# Altium project IP_Audio_Terminal.PrjPcb
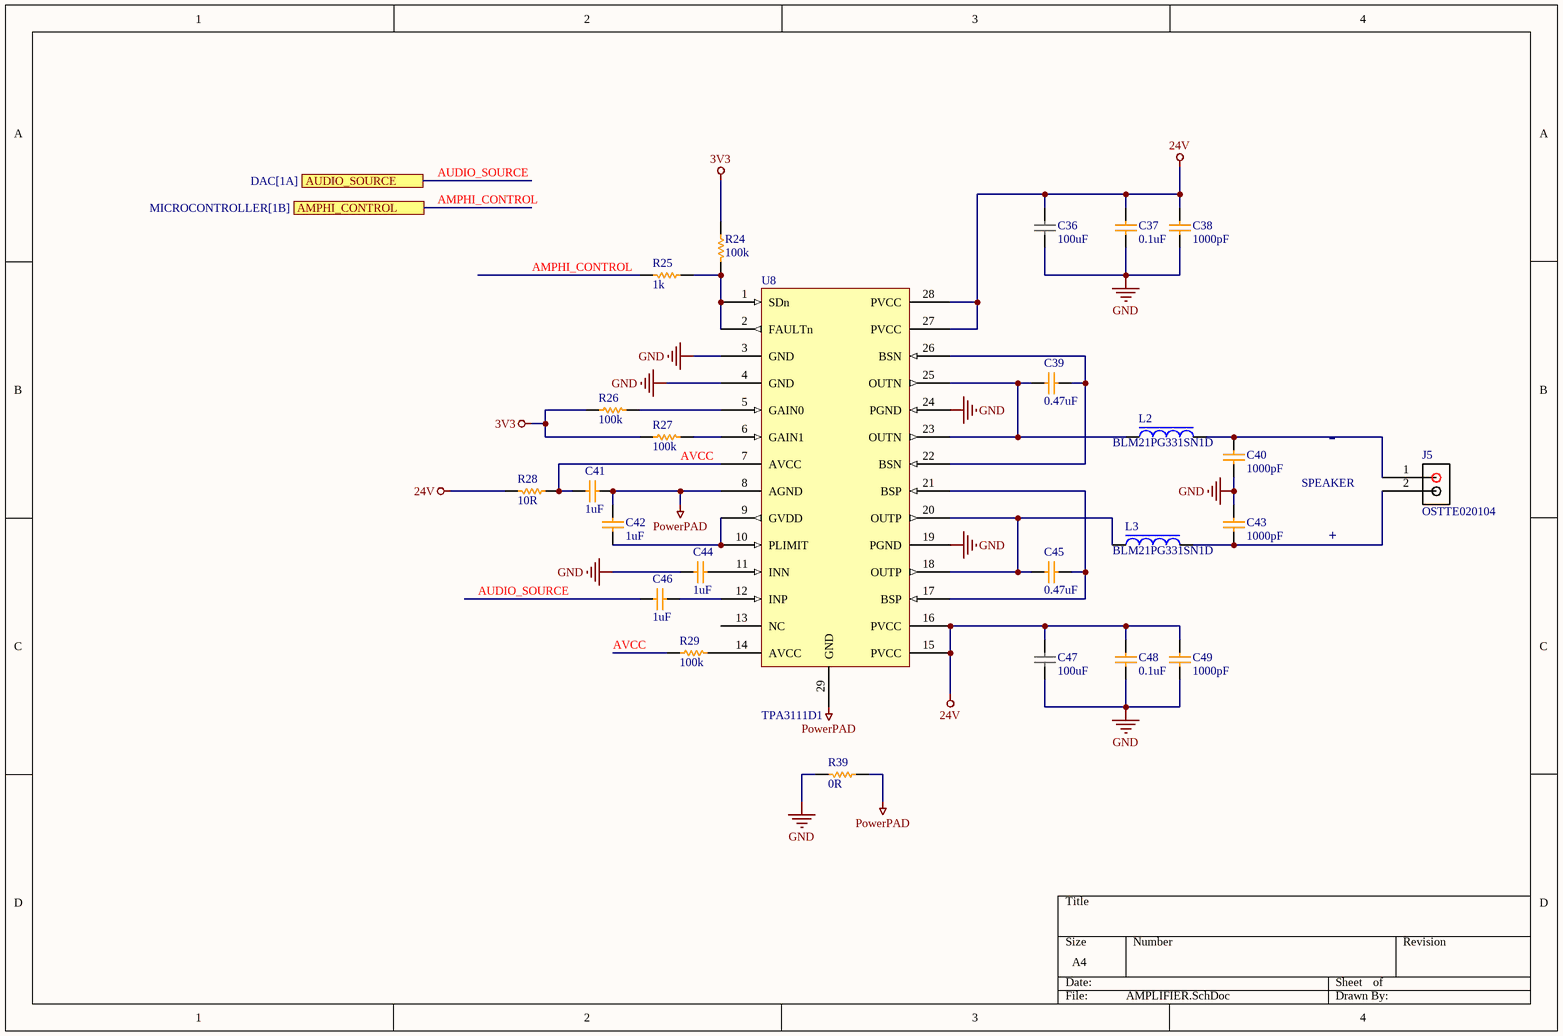
[diagram p0: AMPLIFIER.SchDoc]
6 sheets, 115 parts. Net scope: flat (ports and power ports of the same name join across sheets).
Board file: tetrapcb.PcbDoc
Sheets:
  AMPLIFIER.SchDoc
  DAC.SchDoc
  ETHERNET.SchDoc
  MICROCONTROLLER.SchDoc
  MICROSD.SchDoc
  POWER.SchDoc

## Sheet AMPLIFIER.SchDoc
size A4; SheetNumber: 1; SheetTotal: 6

### Parts
C36  100uF  [CAP-SMD-10x10]
C37  0.1uF  [CAP-0603]
C38  1000pF  [CAP-0603]
C39  0.47uF  [CAP-0603]
C40  1000pF  [CAP-0603]
C41  1uF  [CAP-0603]
C42  1uF  [CAP-0603]
C43  1000pF  [CAP-0603]
C44  1uF  [CAP-0603]
C45  0.47uF  [CAP-0603]
C46  1uF  [CAP-0603]
C47  100uF  [CAP-SMD-10x10]
C48  0.1uF  [CAP-0603]
C49  1000pF  [CAP-0603]
J5  OSTTE020104  [TERMBLK-P3.5-SIDEENT]
L2  BLM21PG331SN1D  [FB-0805]
L3  BLM21PG331SN1D  [FB-0805]
R24  100k  [RES-0603]
R25  1k  [RES-0603]
R26  100k  [RES-0603]
R27  100k  [RES-0603]
R28  10R  [RES-0603]
R29  100k  [RES-0603]
R39  0R  [RES-0603]
U8  TPA3111D1  [28HTSSOP]

### Ports
AMPHI_CONTROL (see MICROCONTROLLER[1B]), AUDIO_SOURCE (see DAC[1A])

### Nets
3V3: R24.2 R26.2 R27.2
24V: C36.1 C37.2 C38.2 C47.1 C48.2 C49.2 R28.1 U8.15(PVCC) U8.16(PVCC) U8.27(PVCC) U8.28(PVCC)
GND: C36.2 C37.1 C38.1 C40.1 C43.2 C44.1 C47.2 C48.1 C49.1 R39.1 U8.3(GND) U8.4(GND) U8.19(PGND) U8.24(PGND)
PowerPAD: C41.2 C42.2 R39.2 U8.8(AGND) U8.29(GND)
AMPHI_CONTROL: R25.1 ; port AMPHI_CONTROL
AUDIO_SOURCE: C46.1 ; port AUDIO_SOURCE
AVCC: C41.1 R28.2 R29.2 U8.7(AVCC)
NetC39_1: C39.1 L2.1 U8.23(OUTN) U8.25(OUTN)
NetC39_2: C39.2 U8.22(BSN) U8.26(BSN)
NetC40_2: C40.2 J5.1 L2.2
NetC42_1: C42.1 U8.9(GVDD) U8.10(PLIMIT)
NetC43_1: C43.1 J5.2 L3.2
NetC44_2: C44.2 U8.11(INN)
NetC45_1: C45.1 L3.1 U8.18(OUTP) U8.20(OUTP)
NetC45_2: C45.2 U8.17(BSP) U8.21(BSP)
NetC46_2: C46.2 U8.12(INP)
NetR24_1: R24.1 R25.2 U8.1(SDn) U8.2(FAULTn)
NetR26_1: R26.1 U8.5(GAIN0)
NetR27_1: R27.1 U8.6(GAIN1)
NetR29_1: R29.1 U8.14(AVCC)

Not connected (* = marked no-connect by the designer): U8 13(NC)

### Notes on the sheet
- -
- SPEAKER
- +

### Library data of the parts
C36 C47 = CAP-SMD-ALUM: CAP ALUM 100UF 20% 50V SMD(UUQ1H101MCL1GS)
C37 C48 = CAP-0603: CAP CER 0.1UF 50V X7R 0805
C38 C40 C43 C49 = CAP-0603: CAP CER 1000PF 50V X7R 0603
C39 C45 = CAP-0603: CAP CER 0.47UF 50V X7R 0805
C41 C42 C44 C46 = CAP-0603: CAP CER 1UF 25V X7R 0603
J5 = OSTTE020104: TERM BLK 2POS SIDE ENT 3.5MM PCB
L2 L3 = FB-0805: FERRITE BEAD 330 OHM 0805 1LN
R24 R26 R27 R29 = RES-0603: RES SMD 100K OHM 1% 1/10W 0603
R25 = RES-0603: RES SMD 1K OHM 1% 1/10W 0603
R28 = RES-0603: RES SMD 10 OHM 1% 1/10W 0603
R39 = RES-0603: RES SMD 0 OHM 1% 1/10W 0603
U8 = TPA3111D1: IC AMP CLASS D MONO 10W 28HTSSOP

## Sheet DAC.SchDoc
size A4; SheetNumber: 2; SheetTotal: 6
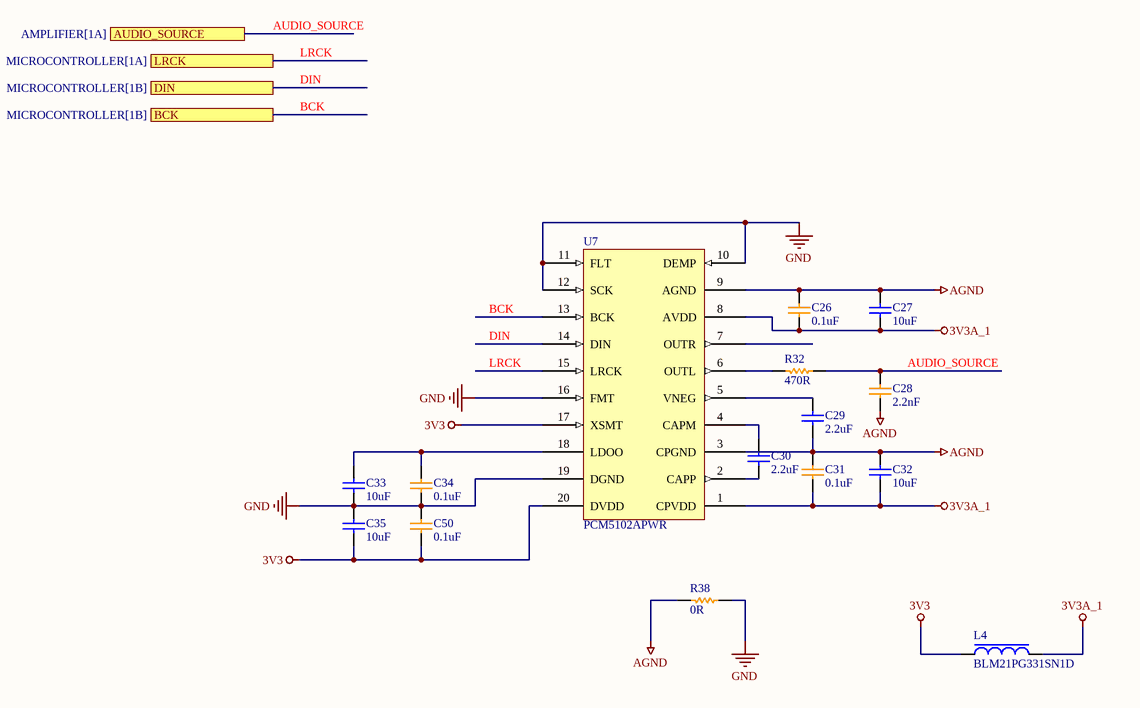
[diagram p1: DAC.SchDoc]

### Parts
C26  0.1uF  [CAP-0603]
C27  10uF  [CAP-0805]
C28  2.2nF  [CAP-0603]
C29  2.2uF  [CAP-0805]
C30  2.2uF  [CAP-0805]
C31  0.1uF  [CAP-0603]
C32  10uF  [CAP-0805]
C33  10uF  [CAP-0805]
C34  0.1uF  [CAP-0603]
C35  10uF  [CAP-0805]
C50  0.1uF  [CAP-0603]
L4  BLM21PG331SN1D  [FB-0805]
R32  470R  [RES-0603]
R38  0R  [RES-0603]
U7  PCM5102APWR  [20-TSSOP]

### Ports
AUDIO_SOURCE (see AMPLIFIER[1A]), BCK (see MICROCONTROLLER[1B]), DIN (see MICROCONTROLLER[1B]), LRCK (see MICROCONTROLLER[1A])

### Nets
3V3: C35.2 C50.2 L4.1 U7.17(XSMT) U7.20(DVDD)
3V3A_1: C26.1 C27.1 C31.1 C32.1 L4.2 U7.1(CPVDD) U7.8(AVDD)
AGND: C26.2 C27.2 C28.2 C29.1 C31.2 C32.2 R38.1 U7.3(CPGND) U7.9(AGND)
GND: C33.2 C34.2 C35.1 C50.1 R38.2 U7.10(DEMP) U7.11(FLT) U7.12(SCK) U7.16(FMT) U7.19(DGND)
AUDIO_SOURCE: C28.1 R32.2 ; port AUDIO_SOURCE
BCK: U7.13(BCK) ; port BCK
DIN: U7.14(DIN) ; port DIN
LRCK: U7.15(LRCK) ; port LRCK
NetC29_2: C29.2 U7.5(VNEG)
NetC30_1: C30.1 U7.2(CAPP)
NetC30_2: C30.2 U7.4(CAPM)
NetC33_1: C33.1 C34.1 U7.18(LDOO)
NetR32_1: R32.1 U7.6(OUTL)

Not connected (* = marked no-connect by the designer): U7 7(OUTR)

### Library data of the parts
C26 C31 C34 C50 = CAP-0603: CAP CER 0.1UF 10V X7R 0603
C27 C32 C35 = CAP-0805: CAP CER 10UF 10V X5R 0805
C28 = CAP-0603: CAP CER 2.2NF 10V C0G/NP0 0603
C29 C30 = CAP-0805: CAP CER 2.2UF 10V X5R 0805
C33 = CAP-0805: CAP CER 10UF 16V X5R 0805
L4 = FB-0805: FERRITE BEAD 330 OHM 0805 1LN
R32 R38 = RES-0603: RES SMD 470 OHM 1% 1/10W 0603
U7 = PCM5102APWR: IC DAS/ADC/DAC SPECIAL 20-TSSOP

## Sheet ETHERNET.SchDoc
size A4; SheetNumber: 3; SheetTotal: 6
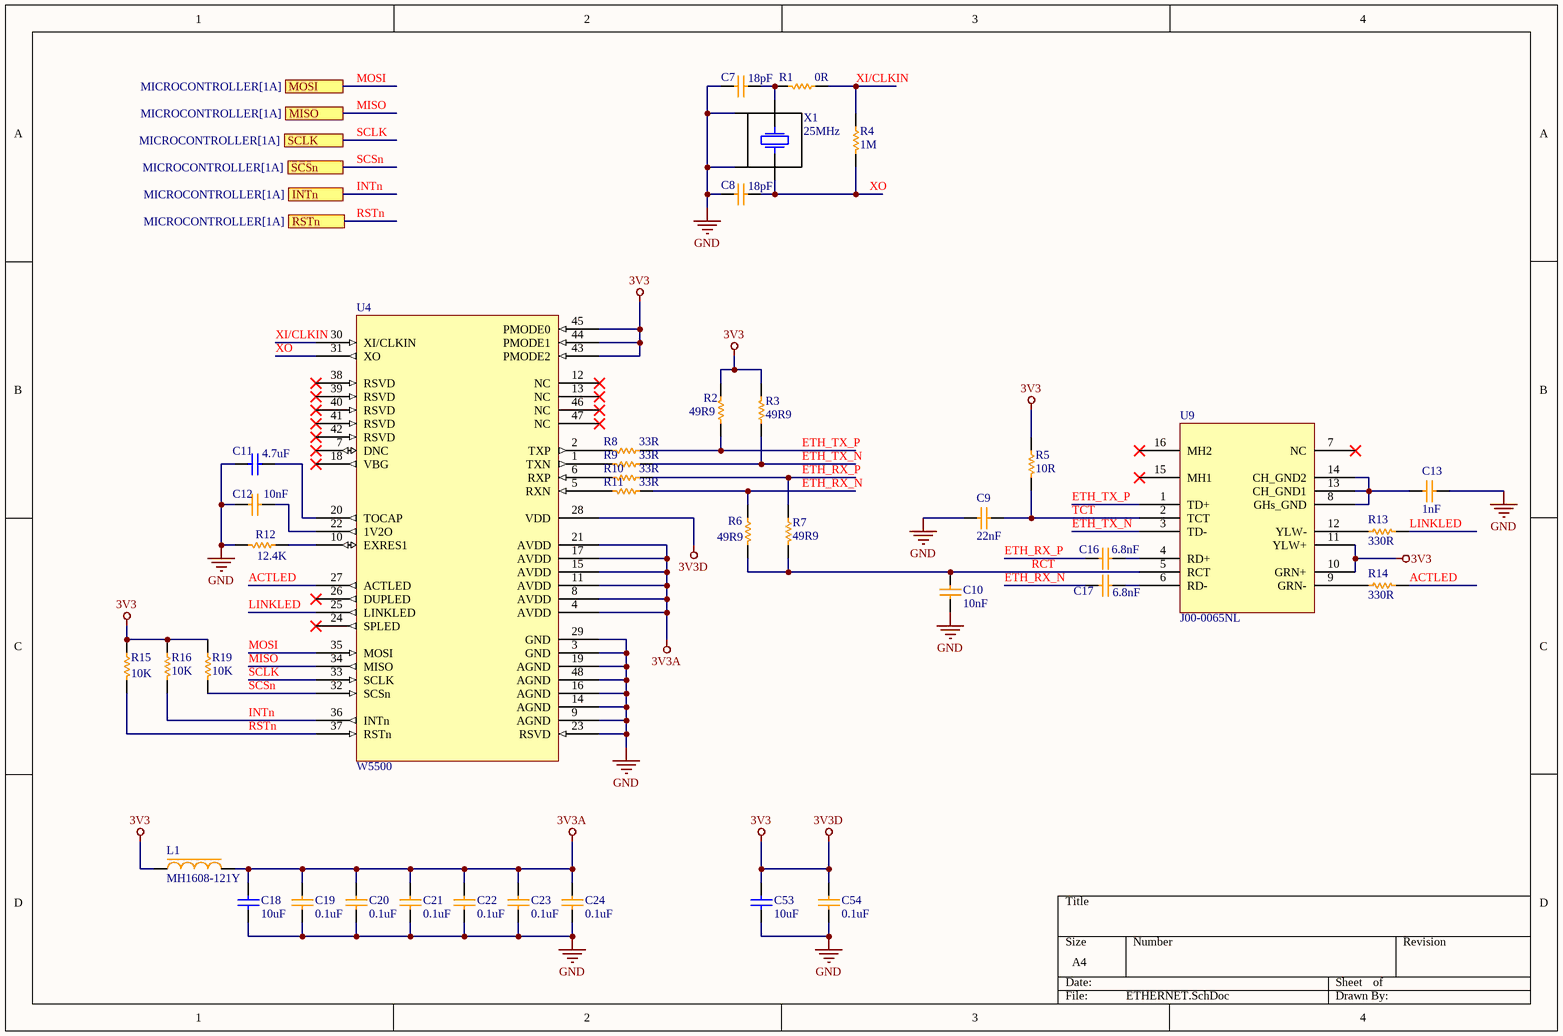
[diagram p2: ETHERNET.SchDoc]

### Parts
C7  18pF  [CAP-0603]
C8  18pF  [CAP-0603]
C9  22nF  [CAP-0603]
C10  10nF  [CAP-0603]
C11  4.7uF  [CAP-0805]
C12  10nF  [CAP-0603]
C13  1nF  [CAP-0603]
C16  6.8nF  [CAP-0603]
C17  6.8nF  [CAP-0603]
C18  10uF  [CAP-0805]
C19  0.1uF  [CAP-0603]
C20  0.1uF  [CAP-0603]
C21  0.1uF  [CAP-0603]
C22  0.1uF  [CAP-0603]
C23  0.1uF  [CAP-0603]
C24  0.1uF  [CAP-0603]
C53  10uF  [CAP-0805]
C54  0.1uF  [CAP-0603]
L1  MH1608-121Y  [FB-0603]
R1  0R  [RES-0603]
R2  49R9  [RES-0603]
R3  49R9  [RES-0603]
R4  1M  [RES-0603]
R5  10R  [RES-0603]
R6  49R9  [RES-0603]
R7  49R9  [RES-0603]
R8  33R  [RES-0603]
R9  33R  [RES-0603]
R10  33R  [RES-0603]
R11  33R  [RES-0603]
R12  12.4K  [RES-0603]
R13  330R  [RES-0603]
R14  330R  [RES-0603]
R15  10K  [RES-0603]
R16  10K  [RES-0603]
R19  10K  [RES-0603]
U4  W5500  [48LQFP]
U9  J00-0065NL  [J00-0065NL]
X1  25MHz  [CRYSTAL-2520]

### Ports
INTn (see MICROCONTROLLER[1A]), MISO (see MICROCONTROLLER[1A]), MOSI (see MICROCONTROLLER[1A]), RSTn (see MICROCONTROLLER[1A]), SCLK (see MICROCONTROLLER[1A]), SCSn (see MICROCONTROLLER[1A])

### Nets
3V3: C53.2 C54.2 L1.1 R2.1 R3.1 R5.2 R15.2 R16.2 R19.2 U4.28(VDD) U4.43(PMODE2) U4.44(PMODE1) U4.45(PMODE0) U9.10(GRN+) U9.11(YLW+)  [also labelled 3V3D]
3V3A: C18.2 C19.2 C20.2 C21.2 C22.2 C23.2 C24.2 L1.2 U4.4(AVDD) U4.8(AVDD) U4.11(AVDD) U4.15(AVDD) U4.17(AVDD) U4.21(AVDD)
GND: C7.1 C8.1 C9.2 C10.1 C11.1 C12.2 C13.2 C18.1 C19.1 C20.1 C21.1 C22.1 C23.1 C24.1 C53.1 C54.1 R12.1 U4.3(GND) U4.9(AGND) U4.14(AGND) U4.16(AGND) U4.19(AGND) U4.23(RSVD) U4.29(GND) U4.48(AGND) X1.2 X1.4
ACTLED: R14.1 U4.27(ACTLED)
ETH_RX_N: C17.1 R6.2 R11.2
ETH_RX_P: C16.1 R7.2 R10.2
ETH_TX_N: R3.2 R9.2 U9.3(TD-)
ETH_TX_P: R2.2 R8.2 U9.1(TD+)
INTn: R16.1 U4.36(INTn) ; port INTn
LINKLED: R13.1 U4.25(LINKLED)
MISO: U4.34(MISO) ; port MISO
MOSI: U4.35(MOSI) ; port MOSI
RCT: C10.2 R6.1 R7.1 U9.5(RCT)
RSTn: R15.1 U4.37(RSTn) ; port RSTn
SCLK: U4.33(SCLK) ; port SCLK
SCSn: R19.1 U4.32(SCSn) ; port SCSn
TCT: C9.1 R5.1 U9.2(TCT)
XI/CLKIN: R1.2 R4.2 U4.30(XI/CLKIN)
XO: C8.2 R4.1 U4.31(XO) X1.3
NetC7_2: C7.2 R1.1 X1.1
NetC11_2: C11.2 U4.20(TOCAP)
NetC12_1: C12.1 U4.22(1V2O)
NetC13_1: C13.1 U9.8(GHs_GND) U9.13(CH_GND1) U9.14(CH_GND2)
NetC16_2: C16.2 U9.4(RD+)
NetC17_2: C17.2 U9.6(RD-)
NetR8_1: R8.1 U4.2(TXP)
NetR9_1: R9.1 U4.1(TXN)
NetR10_1: R10.1 U4.6(RXP)
NetR11_1: R11.1 U4.5(RXN)
NetR12_2: R12.2 U4.10(EXRES1)
NetR13_2: R13.2 U9.12(YLW-)
NetR14_2: R14.2 U9.9(GRN-)

Not connected (* = marked no-connect by the designer): U4 7(DNC)* 12(NC)* 13(NC)* 18(VBG)* 24(SPLED)* 26(DUPLED)* 38(RSVD)* 39(RSVD)* 40(RSVD)* 41(RSVD)* 42(RSVD)* 46(NC)* 47(NC)*; U9 7(NC)* 15(MH1)* 16(MH2)*

### Library data of the parts
C7 C8 = CAP-0603: CAP CER 18PF 50V C0G/NP0 0603
C9 = CAP-0603: CAP CER 22NF 50V X7R 0603
C10 C12 = CAP-0603: CAP CER 1ONF 50V X7R 0603
C11 = CAP-0805: CAP CER 4.7UF 16V X7R 0805
C13 = CAP-0603: CAP CER 1NF 2000V X7R 0603
C16 C17 = CAP-0603: CAP CER 6800PF 50V X7R 0603
C18 C53 = CAP-0805: CAP CER 10UF 16V X5R 0805
C19-C24 C54 = CAP-0603: CAP CER 0.1UF 50V X7R 0603
L1 = FB-0603: FERRITE BEAD 120 OHM 0603 1LN
R1 = RES-0603: RES SMD 0 OHM JUMPER 1/10W 0603
R2 R3 R6 R7 = RES-0603: RES SMD 49.9 OHM 1% 1/10W 0603
R4 = RES-0603: RES SMD 1M OHM 1% 1/10W 0603
R5 = RES-0603: RES SMD 10 OHM 1% 1/10W 0603
R8-R11 = RES-0603: RES SMD 33 OHM 1% 1/10W 0603
R12 = RES-0603: RES SMD 12.4K OHM 1% 1/10W 0603
R13 R14 = RES-0603: RES SMD 330 OHM 5% 1/10W 0603
R15 R16 R19 = RES-0603: RES SMD 10K OHM 5% 1/10W 0603
U4 = W5500: IC CTLR 3-1 ETH TCP/IP 48LQFP
U9 = J00-0065NL: CONN JACK 1PORT PCB
X1 = CRYSTAL-2520: 122M4-25.000F13DWNJK / (2520,25MHz,13pF,10ppm,-40-105,30)

## Sheet MICROCONTROLLER.SchDoc
size A4; SheetNumber: 4; SheetTotal: 6
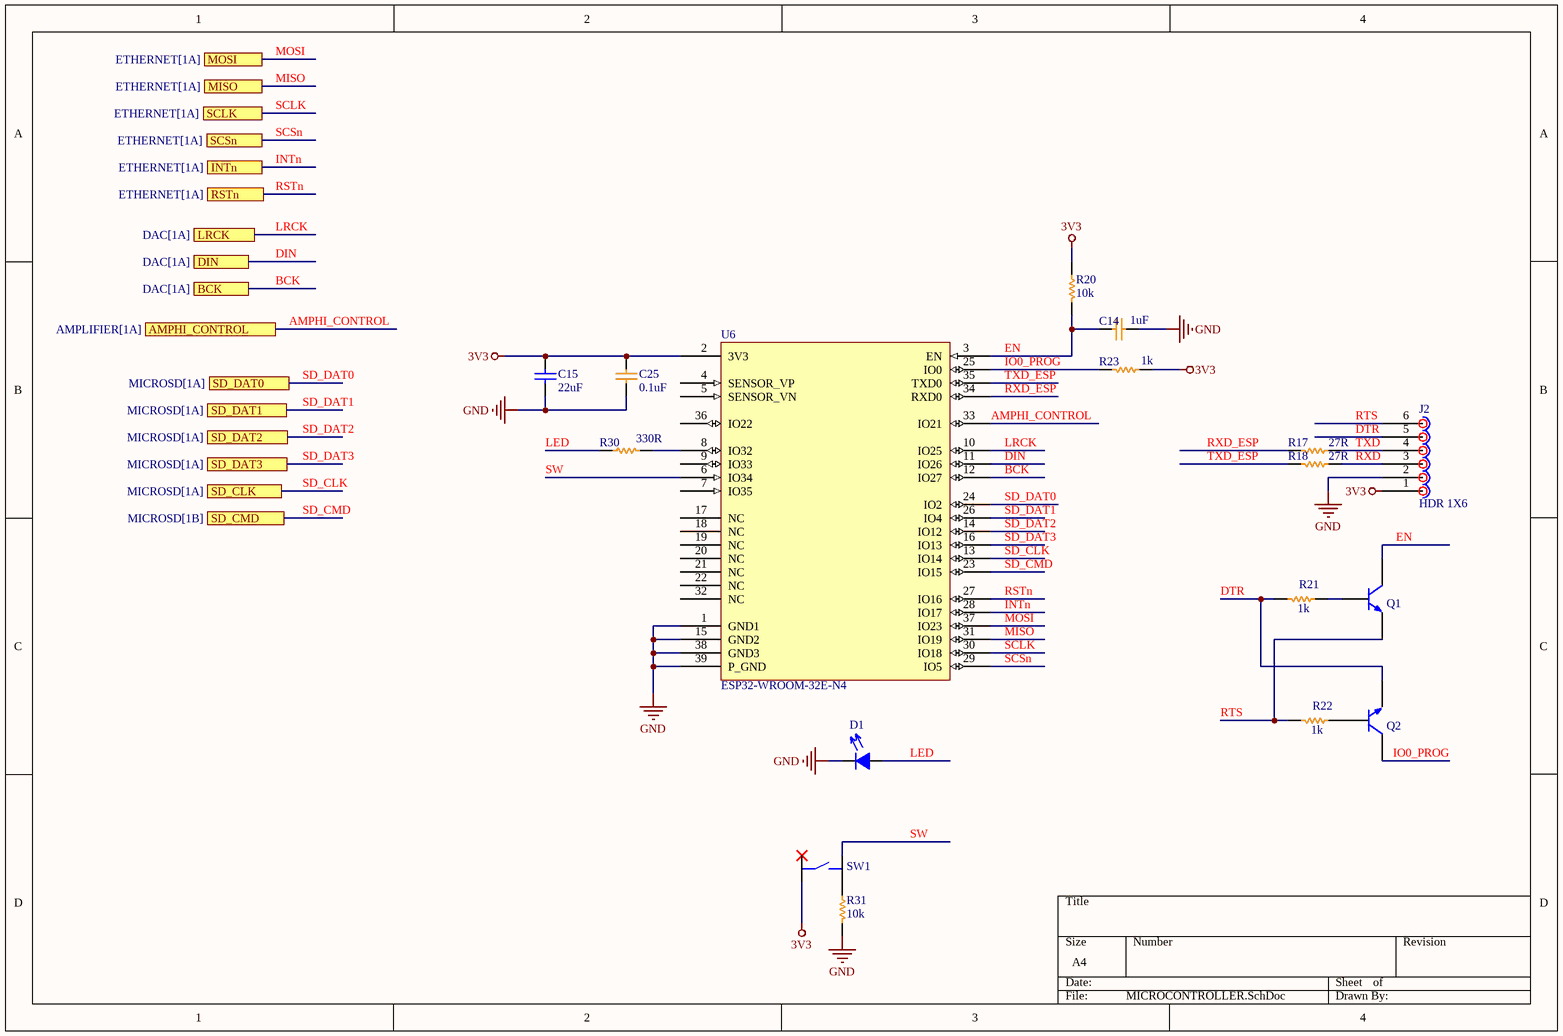
[diagram p3: MICROCONTROLLER.SchDoc]

### Parts
C14  1uF  [CAP-0603]
C15  22uF  [CAP-0805]
C25  0.1uF  [CAP-0603]
D1  LTST-C170GKT  [LED-0805]  (value not drawn)
J2  HDR 1X6  [HDR 1X6]
Q1  S8050  [SOT-23]  (value not drawn)
Q2  S8050  [SOT-23]  (value not drawn)
R17  27R  [RES-0603]
R18  27R  [RES-0603]
R20  10k  [RES-0603]
R21  1k  [RES-0603]
R22  1k  [RES-0603]
R23  1k  [RES-0603]
R30  330R  [RES-0603]
R31  10k  [RES-0603]
SW1  PTS645SK43SMTR92 LFS  [SW-SMD-6x6]  (value not drawn)
U6  ESP32-WROOM-32E-N4  [ESP32-WROOM-32E-N4]

### Ports
AMPHI_CONTROL (see AMPLIFIER[1A]), BCK (see DAC[1A]), DIN (see DAC[1A]), INTn (see ETHERNET[1A]), LRCK (see DAC[1A]), MISO (see ETHERNET[1A]), MOSI (see ETHERNET[1A]), RSTn (see ETHERNET[1A]), SCLK (see ETHERNET[1A]), SCSn (see ETHERNET[1A]), SD_CLK (see MICROSD[1A]), SD_CMD (see MICROSD[1B]), SD_DAT0 (see MICROSD[1A]), SD_DAT1 (see MICROSD[1A]), SD_DAT2 (see MICROSD[1A]), SD_DAT3 (see MICROSD[1A])

### Nets
3V3: C15.2 C25.2 J2.1 R20.2 R23.2 SW1.4 U6.2(3V3)
GND: C14.1 C15.1 C25.1 D1.2 J2.2 R31.1 U6.1(GND1) U6.15(GND2) U6.38(GND3) U6.39(P_GND)
AMPHI_CONTROL: U6.33(IO21) ; port AMPHI_CONTROL
BCK: U6.12(IO27) ; port BCK
DIN: U6.11(IO26) ; port DIN
DTR: J2.5 Q2.2 R21.1
EN: C14.2 Q1.3 R20.1 U6.3(EN)
INTn: U6.28(IO17) ; port INTn
IO0_PROG: Q2.3 R23.1 U6.25(IO0)
LED: D1.1 R30.2
LRCK: U6.10(IO25) ; port LRCK
MISO: U6.31(IO19) ; port MISO
MOSI: U6.37(IO23) ; port MOSI
RSTn: U6.27(IO16) ; port RSTn
RTS: J2.6 Q1.2 R22.1
RXD: J2.3 R18.2
RXD_ESP: R17.1 U6.34(RXD0)
SCLK: U6.30(IO18) ; port SCLK
SCSn: U6.29(IO5) ; port SCSn
SD_CLK: U6.13(IO14) ; port SD_CLK
SD_CMD: U6.23(IO15) ; port SD_CMD
SD_DAT0: U6.24(IO2) ; port SD_DAT0
SD_DAT1: U6.26(IO4) ; port SD_DAT1
SD_DAT2: U6.14(IO12) ; port SD_DAT2
SD_DAT3: U6.16(IO13) ; port SD_DAT3
SW: SW1.1 U6.6(IO34)
TXD: J2.4 R17.2
TXD_ESP: R18.1 U6.35(TXD0)
NetQ1_1: Q1.1 R21.2
NetQ2_1: Q2.1 R22.2
NetR30_1: R30.1 U6.8(IO32)
NetR31_2: R31.2 SW1.2

Not connected (* = marked no-connect by the designer): SW1 3*; U6 4(SENSOR_VP) 5(SENSOR_VN) 7(IO35) 9(IO33) 17(NC) 18(NC) 19(NC) 20(NC) 21(NC) 22(NC) 32(NC) 36(IO22)

### Library data of the parts
C14 = CAP-0603: CAP CER 1UF 10V X7R 0603
C15 = CAP-0805: CAP CER 22UF 10V X5R 0805
C25 = CAP-0603: CAP CER 0.1UF 10V X7R 0603
D1 = LTST-C170GKT: LED GREEN CLEAR SMD
Q1 Q2 = S8050: TRANS NPN 25V 0.5A SOT-23
R17 R18 = RES-0603: RES SMD 27 OHM 1% 1/10W 0603
R20 R31 = RES-0603: RES SMD 10K OHM 1% 1/10W 0603
R21-R23 = RES-0603: RES SMD 1K OHM 1% 1/10W 0603
R30 = RES-0603: RES SMD 330 OHM 5% 1/10W 0603
SW1 = PTS645SK43SMTR92 LFS: G TYPE SMT SWITCH TACTILE SPST-NO 0.05A 12V
U6 = ESP32-WROOM-32E-N4: RF TXRX MOD BT WIFI TH SMD

## Sheet MICROSD.SchDoc
size A4; SheetNumber: 5; SheetTotal: 6
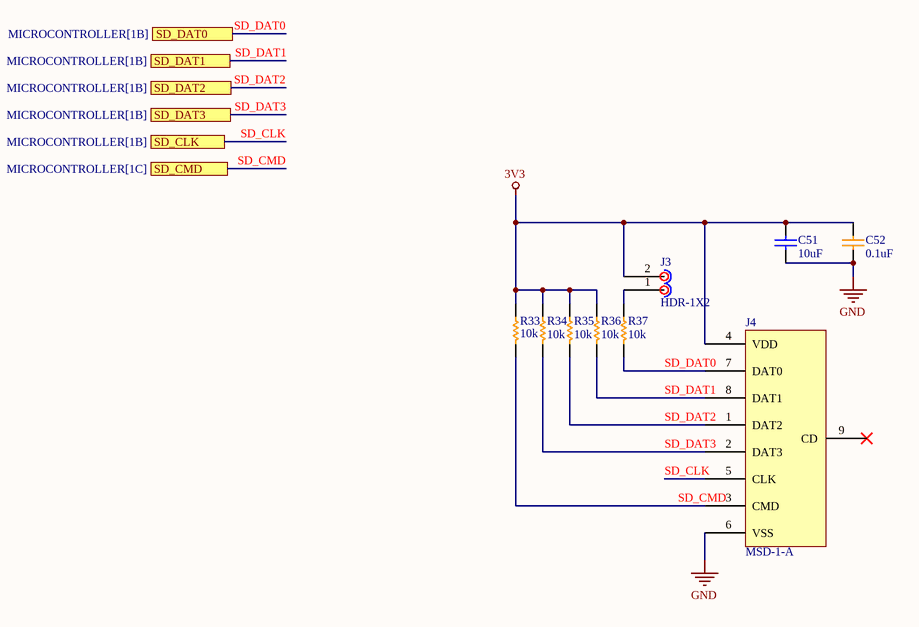
[diagram p4: MICROSD.SchDoc]

### Parts
C51  10uF  [CAP-0805]
C52  0.1uF  [CAP-0603]
J3  HDR-1X2  [HDR-1X2]
J4  MSD-1-A  [MSD-1-A]
R33  10k  [RES-0603]
R34  10k  [RES-0603]
R35  10k  [RES-0603]
R36  10k  [RES-0603]
R37  10k  [RES-0603]

### Ports
SD_CLK (see MICROCONTROLLER[1B]), SD_CMD (see MICROCONTROLLER[1C]), SD_DAT0 (see MICROCONTROLLER[1B]), SD_DAT1 (see MICROCONTROLLER[1B]), SD_DAT2 (see MICROCONTROLLER[1B]), SD_DAT3 (see MICROCONTROLLER[1B])

### Nets
3V3: C51.2 C52.2 J3.2 J4.4(VDD) R33.2 R34.2 R35.2 R36.2
GND: C51.1 C52.1 J4.6(VSS)
SD_CLK: J4.5(CLK) ; port SD_CLK
SD_CMD: J4.3(CMD) R33.1 ; port SD_CMD
SD_DAT0: J4.7(DAT0) R37.1 ; port SD_DAT0
SD_DAT1: J4.8(DAT1) R36.1 ; port SD_DAT1
SD_DAT2: J4.1(DAT2) R35.1 ; port SD_DAT2
SD_DAT3: J4.2(DAT3) R34.1 ; port SD_DAT3
NetJ3_1: J3.1 R37.2

Not connected (* = marked no-connect by the designer): J4 9(CD)*

### Library data of the parts
C51 = CAP-0805: CAP CER 22UF 10V X5R 0805
C52 = CAP-0603: CAP CER 0.1UF 10V X7R 0603
J4 = MSD-1-A: CONN MICROSD CARD R/A SMD
R33-R37 = RES-0603: RES SMD 10K OHM 1% 1/10W 0603

## Sheet POWER.SchDoc
size A4; SheetNumber: 6; SheetTotal: 6
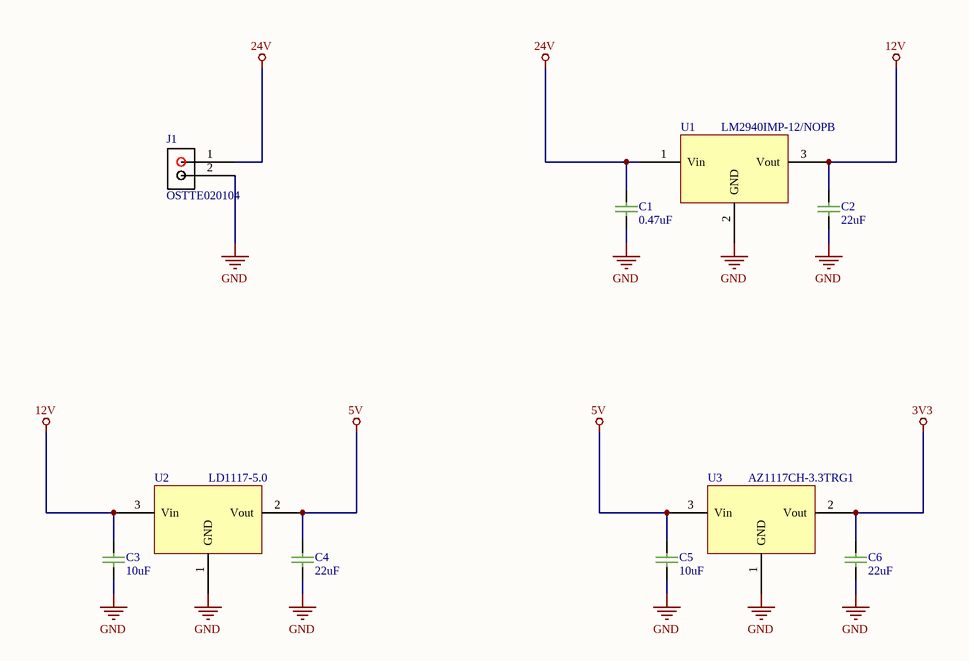
[diagram p5: POWER.SchDoc]

### Parts
C1  0.47uF  [CAP-1206]
C2  22uF  [CAP-1206]
C3  10uF  [CAP-1206]
C4  22uF  [CAP-1206]
C5  10uF  [CAP-1206]
C6  22uF  [CAP-1206]
J1  OSTTE020104  [TERMBLK-P3.5-SIDEENT]
U1  LM2940IMP-12/NOPB  [SOT-223]
U2  LD1117-5.0  [SOT-223]
U3  AZ1117CH-3.3TRG1  [SOT-223]

### Nets
3V3: C6.2 U3.2(Vout)
5V: C4.2 C5.2 U2.2(Vout) U3.3(Vin)
12V: C2.2 C3.2 U1.3(Vout) U2.3(Vin)
24V: C1.2 J1.1 U1.1(Vin)
GND: C1.1 C2.1 C3.1 C4.1 C5.1 C6.1 J1.2 U1.2(GND) U2.1(GND) U3.1(GND)

### Library data of the parts
C1 = CAP-1206: CAP CER 0.47UF 50V X7R 1206
C2 = CAP-1206: CAP CER 22UF 25V X5R 1206
C3 = CAP-1206: CAP CER 10UF 25V X5R 1206
C4 = CAP-1206: CAP CER 22UF 16V X5R 1206
C5 = CAP-1206: CAP CER 10UF 16V X5R 1206
C6 = CAP-1206: CAP CER 22UF 10V X5R 1206
J1 = OSTTE020104: TERM BLK 2POS SIDE ENT 3.5MM PCB
U1 = LM2940IMP-12/NOPB: IC REG LINEAR 12V 1A SOT-223-4
U2 = LD1117-5.0: IC REG LINEAR 5V 1A SOT-223-3L
U3 = AZ1117CH-3.3TRG1: IC REG LINEAR 3.3V 1A SOT-223-3

## Nets that join several sheets
3V3: AMPLIFIER (R24.2 R26.2 R27.2), DAC (5 pins), ETHERNET (15 pins), MICROCONTROLLER (7 pins), MICROSD (8 pins), POWER (C6.2 U3.2)
24V: AMPLIFIER (11 pins), POWER (C1.2 J1.1 U1.1)
GND: AMPLIFIER (14 pins), DAC (10 pins), ETHERNET (27 pins), MICROCONTROLLER (10 pins), MICROSD (C51.1 C52.1 J4.6), POWER (10 pins)
AMPHI_CONTROL: AMPLIFIER (R25.1), MICROCONTROLLER (U6.33)
AUDIO_SOURCE: AMPLIFIER (C46.1), DAC (C28.1 R32.2)
BCK: DAC (U7.13), MICROCONTROLLER (U6.12)
DIN: DAC (U7.14), MICROCONTROLLER (U6.11)
INTn: ETHERNET (R16.1 U4.36), MICROCONTROLLER (U6.28)
LRCK: DAC (U7.15), MICROCONTROLLER (U6.10)
MISO: ETHERNET (U4.34), MICROCONTROLLER (U6.31)
MOSI: ETHERNET (U4.35), MICROCONTROLLER (U6.37)
RSTn: ETHERNET (R15.1 U4.37), MICROCONTROLLER (U6.27)
SCLK: ETHERNET (U4.33), MICROCONTROLLER (U6.30)
SCSn: ETHERNET (R19.1 U4.32), MICROCONTROLLER (U6.29)
SD_CLK: MICROCONTROLLER (U6.13), MICROSD (J4.5)
SD_CMD: MICROCONTROLLER (U6.23), MICROSD (J4.3 R33.1)
SD_DAT0: MICROCONTROLLER (U6.24), MICROSD (J4.7 R37.1)
SD_DAT1: MICROCONTROLLER (U6.26), MICROSD (J4.8 R36.1)
SD_DAT2: MICROCONTROLLER (U6.14), MICROSD (J4.1 R35.1)
SD_DAT3: MICROCONTROLLER (U6.16), MICROSD (J4.2 R34.1)